# EAGLE schematic portableSpcPlayer (EAGLE 7.6.0)
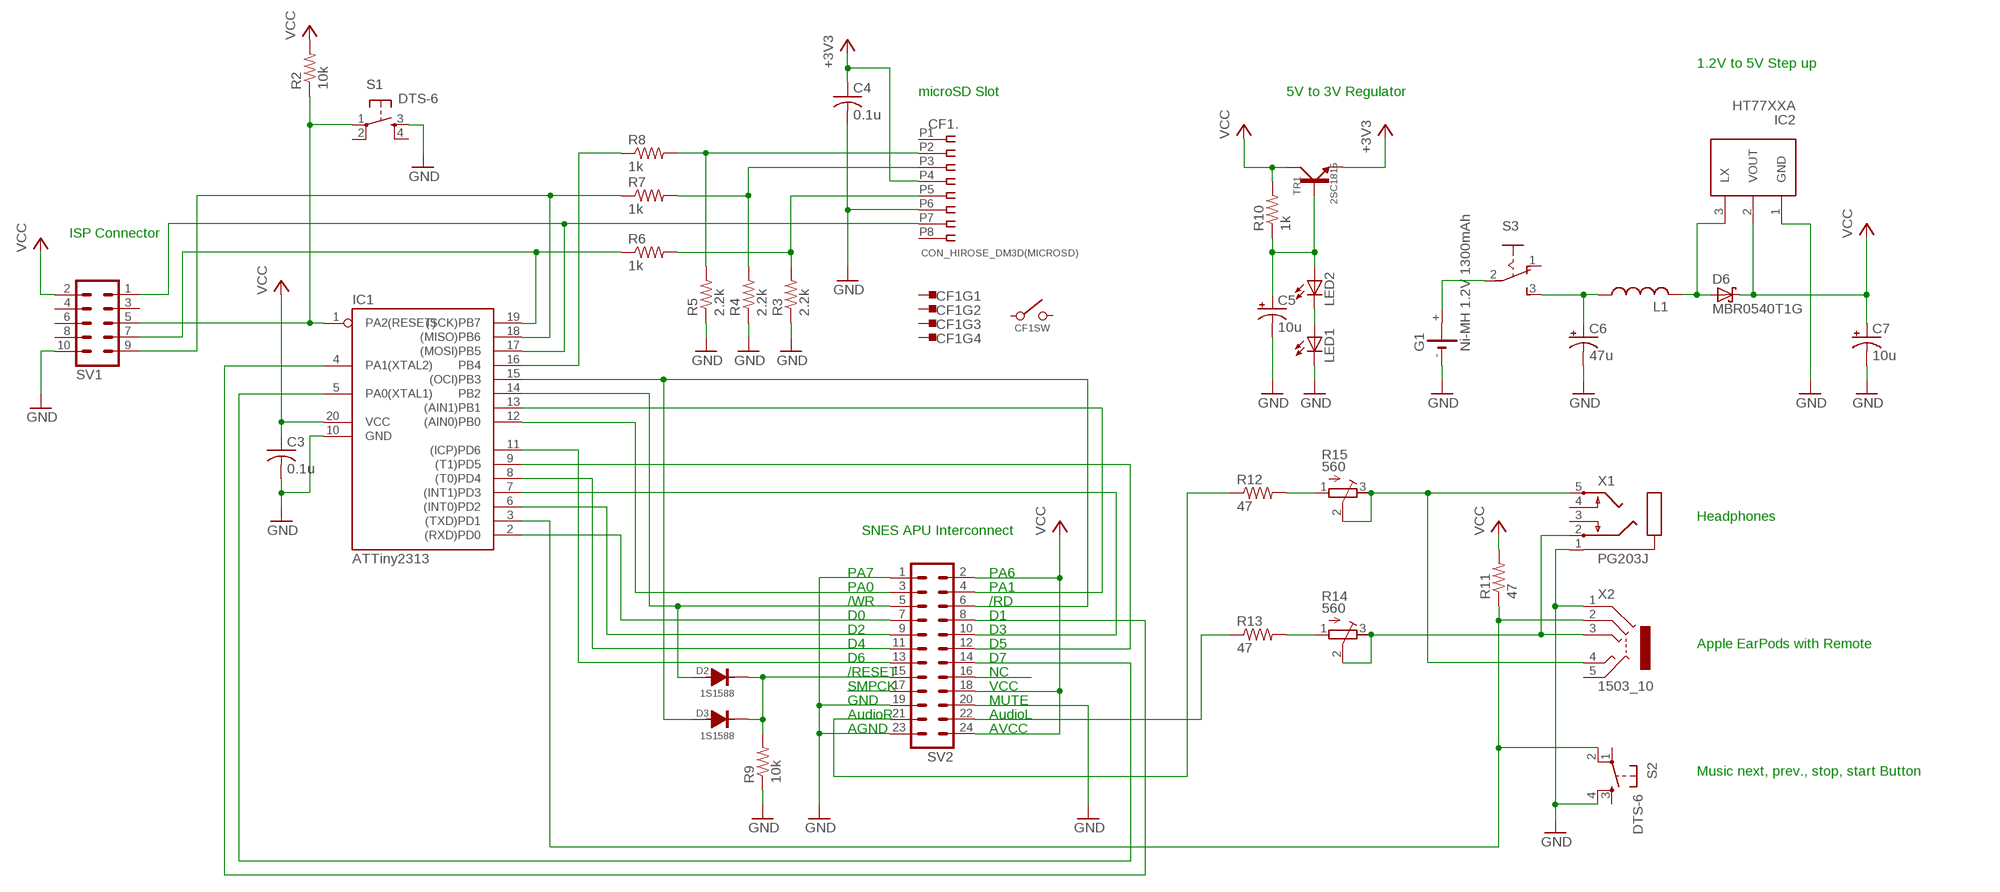
[diagram p0: schematic, sheet 1]

## Parts
C3  0.1u  C-US050-024X044  [C050-024X044]
C4  0.1u  C-US050-024X044  [C050-024X044]
C5  10u  CPOL-USE5-5  [E5-5]
C6  47u  CPOL-USE5-5  [E5-5]
C7  10u  CPOL-USE5-5  [E5-5]
CF1  CON_HIROSE_DM3D(MICROSD)  [HIROSE_DM3D(MICRO-SD)]
D2  1S1588  [DIODE-D-5]
D3  1S1588  [DIODE-D-5]
D6  MBR0540T1G  1N5817-B  [DO41-7.6]
G1  Ni-MH 1.2V 1300mAh  CR-AA  [CRAA]
IC1  ATTiny2313  AT90S2313P  [DIL20]
IC2  HT77XXA  [TO92-N]
L1  L-US0204/7  [0204/7]
LED1  LED3MM  [LED3MM]
LED2  LED3MM  [LED3MM]
R2  10k  R-US_0204/5  [0204/5]
R3  2.2k  R-US_0204/5  [0204/5]
R4  2.2k  R-US_0204/5  [0204/5]
R5  2.2k  R-US_0204/5  [0204/5]
R6  1k  R-US_0204/5  [0204/5]
R7  1k  R-US_0204/5  [0204/5]
R8  1k  R-US_0204/5  [0204/5]
R9  10k  R-US_0204/5  [0204/5]
R10  1k  R-US_0204/5  [0204/5]
R11  47  R-US_0204/5  [0204/5]
R12  47  R-US_0204/5  [0204/5]
R13  47  R-US_0204/5  [0204/5]
R14  560  R-TRIMM4G/J  [RTRIM4G/J]
R15  560  R-TRIMM4G/J  [RTRIM4G/J]
S1  DTS-6  [DTS-6]
S2  DTS-6  [DTS-6]
S3  255SB  [255SB]
SV1  MA05-2  [MA05-2]
SV2  MA12-2  [MA12-2]
TR1  2SC1815  [TO92-]
X1  PG203J  [PG203J]
X2  1503_10  [1503_10]

## Nets
+3V3: C4.1 CF1.P4 TR1.3
GND: C3.2 C4.2 C5.- C6.- C7.- CF1.P6 G1.- IC1.10(GND) IC2.1(GND) LED1.K(C) R3.1 R4.1 R5.1 R9.1 S1.3 S2.4 SV1.10 SV2.1 SV2.19 SV2.20 SV2.23 X1.1 X2.1
N$1: IC1.1(PA2(RESET)) R2.1 S1.1 SV1.5
N$2: IC1.19((SCK)PB7) R6.1 SV1.7
N$3: IC1.18((MISO)PB6) R7.1 SV1.9
N$4: CF1.P7 IC1.17((MOSI)PB5) SV1.1
N$5: CF1.P2 R5.2 R8.2
N$6: IC1.16(PB4) R8.1
N$7: CF1.P3 R4.2 R7.2
N$8: CF1.P5 R3.2 R6.2
N$9: SV2.16
N$10: IC1.12((AIN0)PB0) SV2.3
N$11: D2.P$1 D3.P$1 R9.2 SV2.15
N$12: D2.P$2 IC1.14(PB2) SV2.5
N$13: D3.P$2 IC1.15((OCI)PB3) SV2.6
N$14: IC1.13((AIN1)PB1) SV2.4
N$15: IC1.2((RXD)PD0) SV2.7
N$16: IC1.6((INT0)PD2) SV2.9
N$17: IC1.7((INT1)PD3) SV2.10
N$18: IC1.8((T0)PD4) SV2.11
N$19: IC1.9((T1)PD5) SV2.12
N$20: IC1.11((ICP)PD6) SV2.13
N$21: IC1.5(PA0(XTAL1)) SV2.14
N$22: R13.2 R14.1(A)
N$23: SV2.17
N$24: C5.+ LED2.A R10.1 TR1.1
N$25: D6.A IC2.3(LX) L1.2
N$26: LED1.A LED2.K(C)
N$27: R12.1 SV2.21
N$28: C6.+ L1.1 S3.3(S)
N$29: R13.1 SV2.22
N$30: IC1.4(PA1(XTAL2)) SV2.8
N$31: G1.+ S3.2(P)
N$32: R12.2 R15.1(A)
N$34: R14.2(S) R14.3(E) X1.2 X2.3
N$35: R15.2(S) R15.3(E) X1.5 X2.4
N$36: IC1.3((TXD)PD1) R11.1 S2.2 X2.2
VCC: C3.1 C7.+ D6.C IC1.20(VCC) IC2.2(VOUT) R2.2 R10.2 R11.2 SV1.2 SV2.2 SV2.18 SV2.24 TR1.2
Unconnected: CF1.G1(PAD) CF1.G2(PAD) CF1.G3(PAD) CF1.G4(PAD) CF1.P1 CF1.P8 CF1.S0 CF1.S1 G1.+@1(+) S1.2 S1.4 S2.1 S2.3 S3.1(O) SV1.3 SV1.4 SV1.6 SV1.8 X1.3 X1.4 X2.5

## Notes on the sheet
- 1.2V to 5V Step up
- microSD Slot | 5V to 3V Regulator
- ISP Connector
- Headphones
- SNES APU Interconnect
- PA7 | PA6
- PA0 | PA1
- /WR | /RD
- D0 | D1
- D2 | D3
- D4 | D5 | Apple EarPods with Remote
- D6 | D7
- /RESET | NC
- SMPCK | VCC
- GND | MUTE
- AudioR | AudioL
- AGND | AVCC
- Music next, prev., stop, start Button

## Library data of the parts
C3 C4 = rcl:C-US: CAPACITOR, American symbol
C5-C7 = rcl:CPOL-US: POLARIZED CAPACITOR, American symbol
CF1 = con-usd-hirose-dm3:CON_HIROSE_DM3*: Hirose μSD card socket without ejection mechanism. Approx 12x12 mm
D2 D3 = jikken:1S1588
D6 = diode:1N581*: 1.0A SCHOTTKY BARRIER RECTIFIER Source: http://www.diodes.com/datasheets/ds23001.pdf
G1 = battery:CR-AA: LI BATTERY Varta CRAA-SLF
IC1 = atmel:AT90S2313: MICROCONTROLLER 2 Kbytes FLASH 128 bytes SRAM 128 bytes EEPROM UART; OC_FARNELL: unknown; OC_NEWARK: unknown
IC2 = HT77xx:HT77XX
L1 = resistor:L-US: INDUCTOR, American symbol
LED1 LED2 = led:LED: LED OSRAM: - CHIPLED LG R971, LG N971, LY N971, LG Q971, LY Q971, LO R971, LY R971 LH N974, LH R974 LS Q976, LO Q976, LY Q976 LO Q996 - Hyper CHIPLED LW Q18S LB Q993, LB Q99A, LB R99A - SideLED LS A670, LO A670, LY A670, LG A670, LP A670 LB A673, LV A673, LT A673, LW A673 LH A674 LY A675 LS A676, LA A676, LO A676, LY A676, LW A676 LS A679, LY A679, LG A679 - Hyper Micro SIDELED® LS Y876, LA Y876, LO Y876, LY Y876 LT Y87S - SmartLED LW L88C, LW L88S LB L89C, LB L89S, LG L890 LS L89K, LO L89K, LY L89K LS L896, LA L896, LO L896, LY L896 - TOPLED LS T670, LO T670, LY T670, LG T670, LP T670 LSG T670, LSP T670, LSY T670, LOP T670, LYG T670 LG T671, LOG T671, LSG T671 LB T673, LV T673, LT T673, LW T673 LH T674 LS T676, LA T676, LO T676, LY T676, LB T676, LH T676, LSB T676, LW T676 LB T67C, LV T67C, LT T67C, LS T67K, LO T67K, LY T67K, LW E67C LS E67B, LA E67B, LO E67B, LY E67B, LB E67C, LV E67C, LT E67C LW T67C LS T679, LY T679, LG T679 LS T770, LO T770, LY T770, LG T770, LP T770 LB T773, LV T773, LT T773, LW T773 LH T774 LS E675, LA E675, LY E675, LS T675 LS T776, LA T776, LO T776, LY T776, LB T776 LHGB T686 LT T68C, LB T68C - Hyper Mini TOPLED® LB M676 - Mini TOPLED Santana® LG M470 LS M47K, LO M47K, LY M47K Source: http://www.osram.convergy.de LUXEON: - LUMILED® LXK2-PW12-R00, LXK2-PW12-S00, LXK2-PW14-U00, LXK2-PW14-V00 LXK2-PM12-R00, LXK2-PM12-S00, LXK2-PM14-U00 LXK2-PE12-Q00, LXK2-PE12-R00, LXK2-PE12-S00, LXK2-PE14-T00, LXK2-PE14-U00 LXK2-PB12-K00, LXK2-PB12-L00, LXK2-PB12-M00, LXK2-PB14-N00, LXK2-PB14-P00, LXK2-PB14-Q00 LXK2-PR12-L00, LXK2-PR12-M00, LXK2-PR14-Q00, LXK2-PR14-R00 LXK2-PD12-Q00, LXK2-PD12-R00, LXK2-PD12-S00 LXK2-PH12-R00, LXK2-PH12-S00 LXK2-PL12-P00, LXK2-PL12-Q00, LXK2-PL12-R00 Source: www.luxeon.com KINGBRIGHT: KA-3528ASYC Source: www.kingbright.com
R2-R13 = rcl:R-US_: RESISTOR, American symbol
R14 R15 = rcl:R-TRIMM: Trimm resistor
S1 S2 = switch-tact:DTS-6
S3 = switch:255SB: SLIDING SWITCH Distributor Buerklin, 11G810
SV1 = con-lstb:MA05-2: PIN HEADER; OC_FARNELL: unknown; OC_NEWARK: unknown
SV2 = con-lstb:MA12-2: PIN HEADER; OC_FARNELL: unknown; OC_NEWARK: unknown
TR1 = jikken:2SC1815
X1 = con-hirschmann:PG203J: MIC/HEADPHONE JACK KS-S stereo microphone/headphone jack PG203JN (Schukat); OC_FARNELL: unknown; OC_NEWARK: unknown
X2 = con-lumberg:1503_10: Jack connectors according to JISC 6560, 3.5 mm Klinkeneinbaukupplung, 3,5 mm, 4-polig/stereo, abgewinkelte Ausführung Source: http://www.lumberg.de/Produkte/PDFs/1503_10.pdf; OC_FARNELL: 1308868; OC_NEWARK: unknown